# EAGLE design up-rtr_1.0 (EAGLE 5.08)
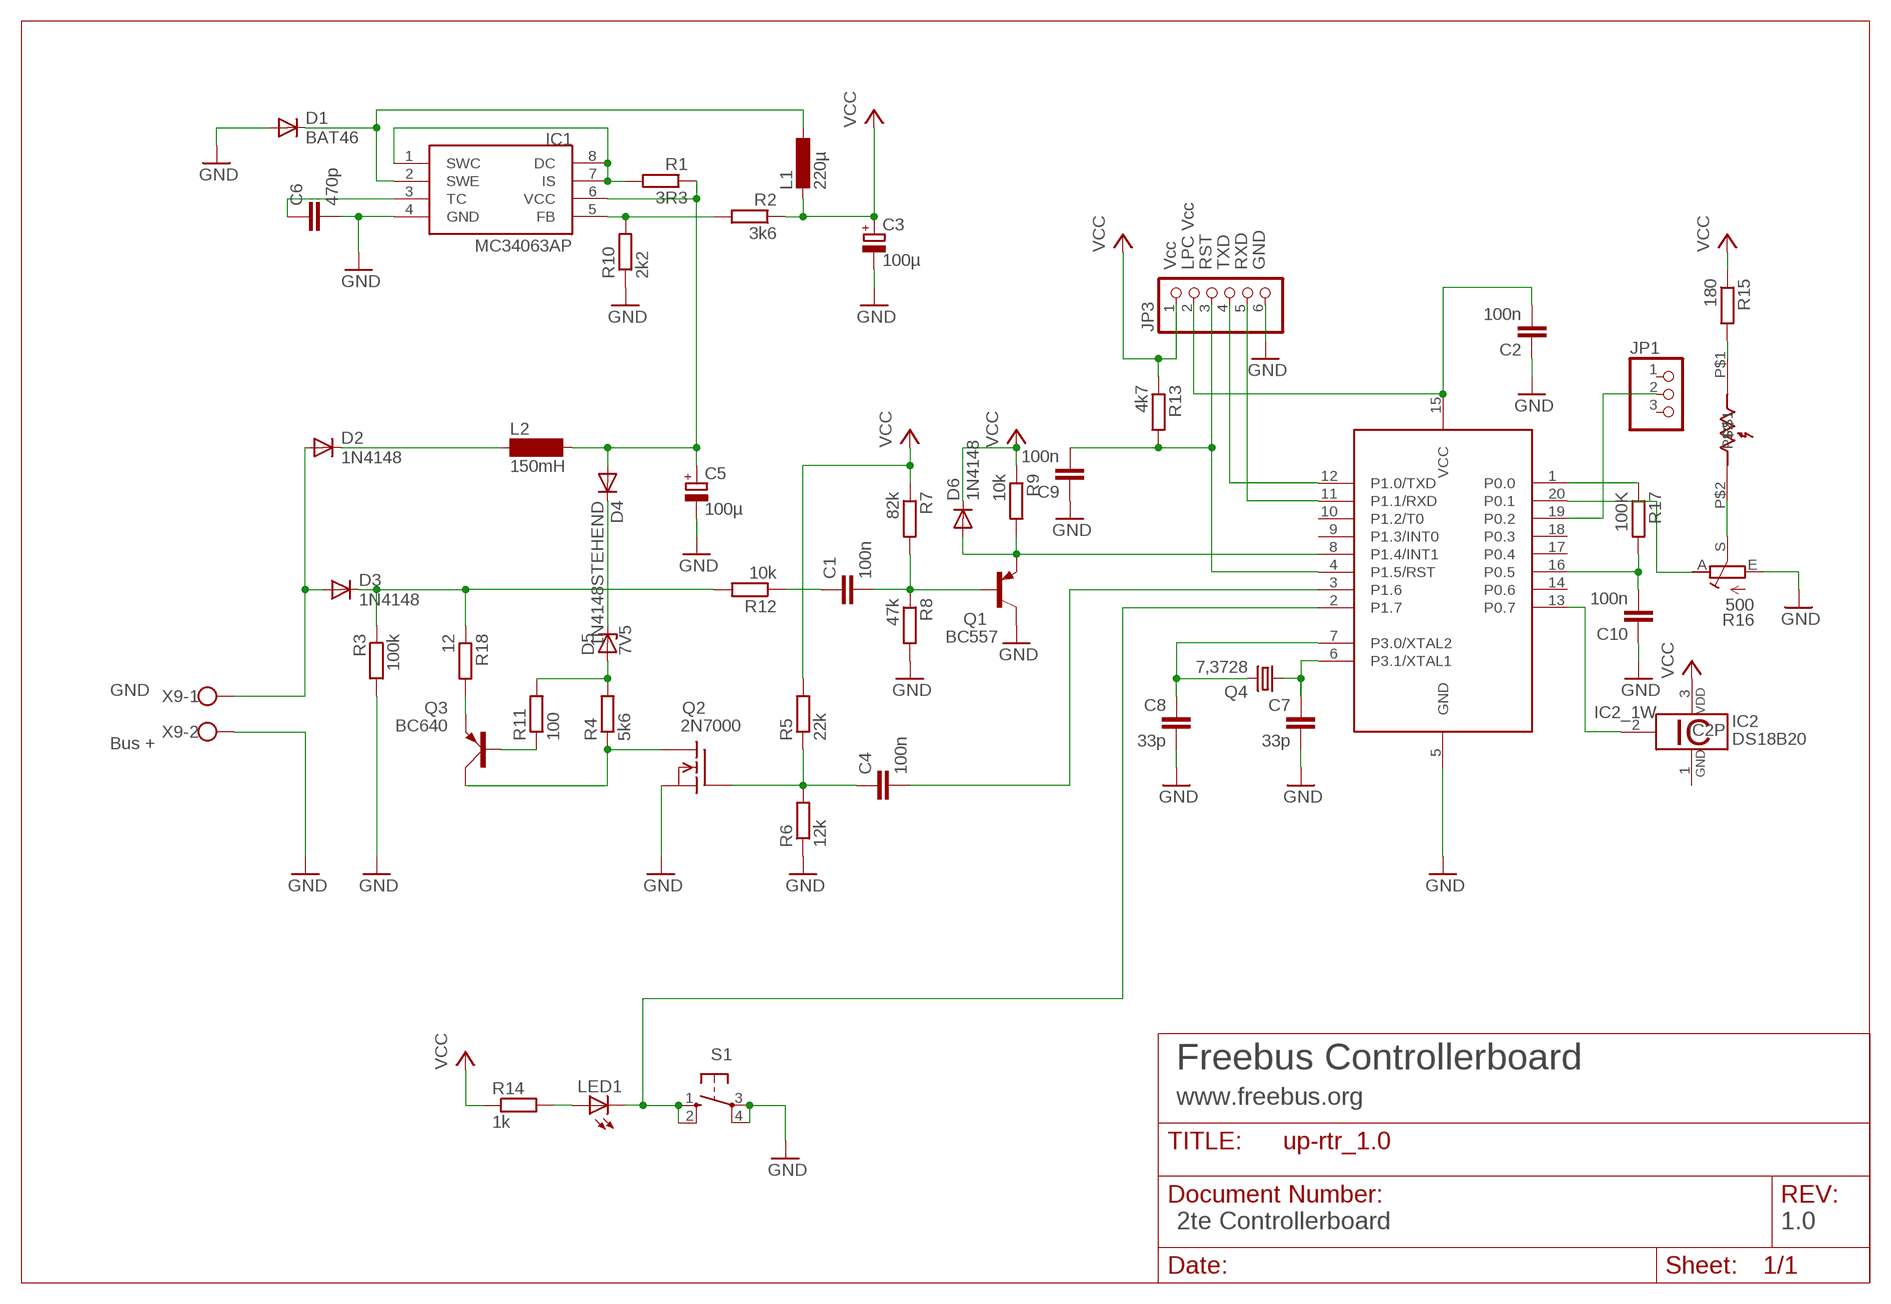
[diagram p0: schematic, sheet 1]

## Parts
89LPC922  89LPC922  [DIL20]
C1  100n  C-EU025-025X050  [C025-025X050]
C2  100n  C-EUC0805  [C0805]
C3  100µ  CPOL-EUE2.5-6  [E2,5-6]
C4  100n  C-EUC0805  [C0805]
C5  100µ  CPOL-EUE3.5-8  [E3,5-8]
C6  470p  C-EUC0805  [C0805]
C7  33p  C-EUC0805  [C0805]
C8  33p  C-EUC0805  [C0805]
C9  100n  C-EUC0805  [C0805]
C10  100n  C-EUC0805  [C0805]
D1  BAT46  BAT81  [DO34-7]
D2  1N4148  1N4148STEHEND  [D-2.5]
D3  1N4148  1N4148STEHEND  [D-2.5]
D4  1N4148STEHEND  [D-2.5]
D5  7V5  ZPDSTEHEND  [ZDIODE]
D6  1N4148  1N4148STEHEND  [D-2.5]
IC1  MC34063AP  [DIL08]
IC2  DS18B20  [TO92-]
JP1  PINHD-1X3  [1X03]
JP3  PINHD-1X6  [1X06]
L1  220µ  L-EU0207/12  [0207/12]
L2  150mH  BS11  [BS11]
LED1  LED3MM  [LED3MM]
Q1  BC557  [TO92]
Q2  2N7000  VN2222KM  [TO237]
Q3  BC640  [SOT54D]
Q4  7,3728  CRYSTALHC49S  [HC49/S]
R1  3R3  R-EU_R0805  [R0805]
R2  3k6  R-EU_R0805  [R0805]
R3  100k  R-EU_R0805  [R0805]
R4  5k6  R-EU_R0805  [R0805]
R5  22k  R-EU_R0805  [R0805]
R6  12k  R-EU_R0805  [R0805]
R7  82k  R-EU_0207/2V  [0207/2V]
R8  47k  R-EU_0207/2V  [0207/2V]
R9  10k  R-EU_0207/2V  [0207/2V]
R10  2k2  R-EU_R0805  [R0805]
R11  100  R-EU_R0805  [R0805]
R12  10k  R-EU_0207/2V  [0207/2V]
R13  4k7  R-EU_R0805  [R0805]
R14  1k  R-EU_R0805  [R0805]
R15  180  R-EU_R0805  [R0805]
R16  500  R-TRIMM-PT6L  [PT6L]
R17  100K  R-EU_R0805  [R0805]
R18  12  R-EU_R0805  [R0805]
RL1  LDR07  [LDR07]
S1  10-XX  [B3F-10XX]
X9  W237-102  [W237-102]

## Nets
/RESET: 89LPC922.4(P1.5/RST) C9.2 JP3.3 R13.2
BASE: C1.2 Q1.2(B) R7.2 R8.1
EIB+: D2.A D3.A X9.1
FETGATE: C4.1 Q2.2(G) R5.1 R6.2
GND: 89LPC922.5(GND) C2.1 C3.- C5.- C6.2 C7.2 C8.2 C9.1 C10.1 D1.A IC1.4(GND) JP3.6 Q1.3(C) Q2.3(S) R3.2 R6.1 R8.2 R10.1 R16.E S1.3(P) S1.4(P1) X9.2
N$1: 89LPC922.8(P1.4/INT1) D6.A Q1.1(E) R9.2
N$2: C1.1 R12.1
N$3: 89LPC922.7(P3.0/XTAL2) C8.1 Q4.2
N$4: D3.C R3.1 R12.2 R18.1
N$5: 89LPC922.3(P1.6) C4.2
N$6: 89LPC922.6(P3.1/XTAL1) C7.1 Q4.1
N$7: 89LPC922.2(P1.7) LED1.K(C) S1.1(S) S1.2(S1)
N$8: IC1.1(SWC) IC1.7(IS) IC1.8(DC) R1.2
N$9: LED1.A R14.2
N$10: C5.+ D4.A IC1.6(VCC) L2.2 R1.1
N$11: IC1.5(FB) R2.2 R10.2
N$12: D1.C IC1.2(SWE) L1.1
N$13: D2.C L2.1
N$14: C6.1 IC1.3(TC)
N$15: D4.C D5.C
N$16: R15.2 RL1.P$1
N$17: R16.S RL1.P$2
N$18: 89LPC922.13(P0.7) IC2.2
N$19: 89LPC922.20(P0.1) R16.A
N$20: 89LPC922.1(P0.0) R17.1
N$21: 89LPC922.16(P0.5) C10.2 R17.2
N$22: 89LPC922.19(P0.2) JP1.2
N$25: D5.A R4.2 R11.2
N$26: Q2.1(D) Q3.C R4.1
N$28: Q3.B R11.1
N$29: 89LPC922.12(P1.0/TXD) JP3.4
N$30: 89LPC922.11(P1.1/RXD) JP3.5
N$32: 89LPC922.15(VCC) C2.2 JP3.2
N$33: Q3.E R18.2
VCC: C3.+ D6.C IC2.3 JP3.1 L1.2 R2.1 R5.2 R7.1 R9.1 R13.1 R14.1 R15.1
Unconnected: 89LPC922.9(P1.3/INT0) 89LPC922.10(P1.2/T0) 89LPC922.14(P0.6) 89LPC922.17(P0.4) 89LPC922.18(P0.3) JP1.1 JP1.3

## Notes on the sheet
- Vcc | LPC Vcc | RST | TXD | RXD | GND
- GND
- Bus +
- Freebus Controllerboard
- www.freebus.org
- 2te Controllerboard | 1.0

## Power pins joined to a net without a drawn wire
GND: IC2.1

## Library data of the parts
89LPC922 = micro-philips:89LPC922
C1 C2 C4 C6-C10 = rcl:C-EU: CAPACITOR, European symbol
C3 C5 = rcl:CPOL-EU: POLARIZED CAPACITOR, European symbol
D1 = diode:BAT81: DIODE barrier diode
D2-D4 D6 = diode:1N4148: DIODE high speed (Philips)
D5 = diode:ZPD: Z DIODE 500 mW
IC1 = mc34063:MC34063
IC2 = 1wire:DS18B20: Programmable Resolution Digital Thermometer This chip provides a onewire thermosensor with approx. 0.5°C accuracy. A programmable over/undertemperure alarm is available. The precision can be set from 9..12 bits. Notes: Vdd must be applied for accurate measurements at low temperatures, as the parasite power circuit otherwise heats the sensor. If parasite power is used, Vdd has to be connected to GND. The DS1822 is a low-cost thermometer chip, the DS18S20 is similar to the DS18B20, but with 9 Bit precision only. Author: Jan Kandziora <jjj@gmx.de>
JP1 = pinhead:PINHD-1X3: PIN HEADER
JP3 = pinhead:PINHD-1X6: PIN HEADER
L1 = rcl:L-EU: INDUCTOR, European symbol
L2 = inductor-neosid:BS: INDUCTOR nominal inductance, magnetically screened
LED1 = led:LED: LED OSRAM: - CHIPLED LG R971, LG N971, LY N971, LG Q971, LY Q971, LO R971, LY R971 LH N974, LH R974 LS Q976, LO Q976, LY Q976 LO Q996 - Hyper CHIPLED LW Q18S LB Q993, LB Q99A, LB R99A - SideLED LS A670, LO A670, LY A670, LG A670, LP A670 LB A673, LV A673, LT A673, LW A673 LH A674 LY A675 LS A676, LA A676, LO A676, LY A676, LW A676 LS A679, LY A679, LG A679 - Hyper Micro SIDELED® LS Y876, LA Y876, LO Y876, LY Y876 LT Y87S - SmartLED LW L88C, LW L88S LB L89C, LB L89S, LG L890 LS L89K, LO L89K, LY L89K LS L896, LA L896, LO L896, LY L896 - TOPLED LS T670, LO T670, LY T670, LG T670, LP T670 LSG T670, LSP T670, LSY T670, LOP T670, LYG T670 LG T671, LOG T671, LSG T671 LB T673, LV T673, LT T673, LW T673 LH T674 LS T676, LA T676, LO T676, LY T676, LB T676, LH T676, LSB T676, LW T676 LB T67C, LV T67C, LT T67C, LS T67K, LO T67K, LY T67K, LW E67C LS E67B, LA E67B, LO E67B, LY E67B, LB E67C, LV E67C, LT E67C LW T67C LS T679, LY T679, LG T679 LS T770, LO T770, LY T770, LG T770, LP T770 LB T773, LV T773, LT T773, LW T773 LH T774 LS E675, LA E675, LY E675, LS T675 LS T776, LA T776, LO T776, LY T776, LB T776 LHGB T686 LT T68C, LB T68C - Hyper Mini TOPLED® LB M676 - Mini TOPLED Santana® LG M470 LS M47K, LO M47K, LY M47K Source: http://www.osram.convergy.de - LUMILED® LXK2-PW12-R00, LXK2-PW12-S00, LXK2-PW14-U00, LXK2-PW14-V00 LXK2-PM12-R00, LXK2-PM12-S00, LXK2-PM14-U00 LXK2-PE12-Q00, LXK2-PE12-R00, LXK2-PE12-S00, LXK2-PE14-T00, LXK2-PE14-U00 LXK2-PB12-K00, LXK2-PB12-L00, LXK2-PB12-M00, LXK2-PB14-N00, LXK2-PB14-P00, LXK2-PB14-Q00 LXK2-PR12-L00, LXK2-PR12-M00, LXK2-PR14-Q00, LXK2-PR14-R00 LXK2-PD12-Q00, LXK2-PD12-R00, LXK2-PD12-S00 LXK2-PH12-R00, LXK2-PH12-S00 LXK2-PL12-P00, LXK2-PL12-Q00, LXK2-PL12-R00 Source: www.luxeon.com
Q1 = transistor-pnp:BC557: PNP Transistor
Q2 = transistor-fet:VN2222KM: N-Channel Enhancement MOSFET (VMOS); 60V; 0,5A; 7,5Ohm
Q3 = transistor-small-signal:BC640: PNP TRANSISTOR
Q4 = crystal:CRYSTAL: CRYSTAL
R1-R15 R17 R18 = rcl:R-EU_: RESISTOR, European symbol
R16 = kubi:R-TRIMM
RL1 = ldr:LDR07
S1 = switch-omron:10-XX: OMRON SWITCH
X9 = con-wago-500:W237-102: WAGO SCREW CLAMP

## Board
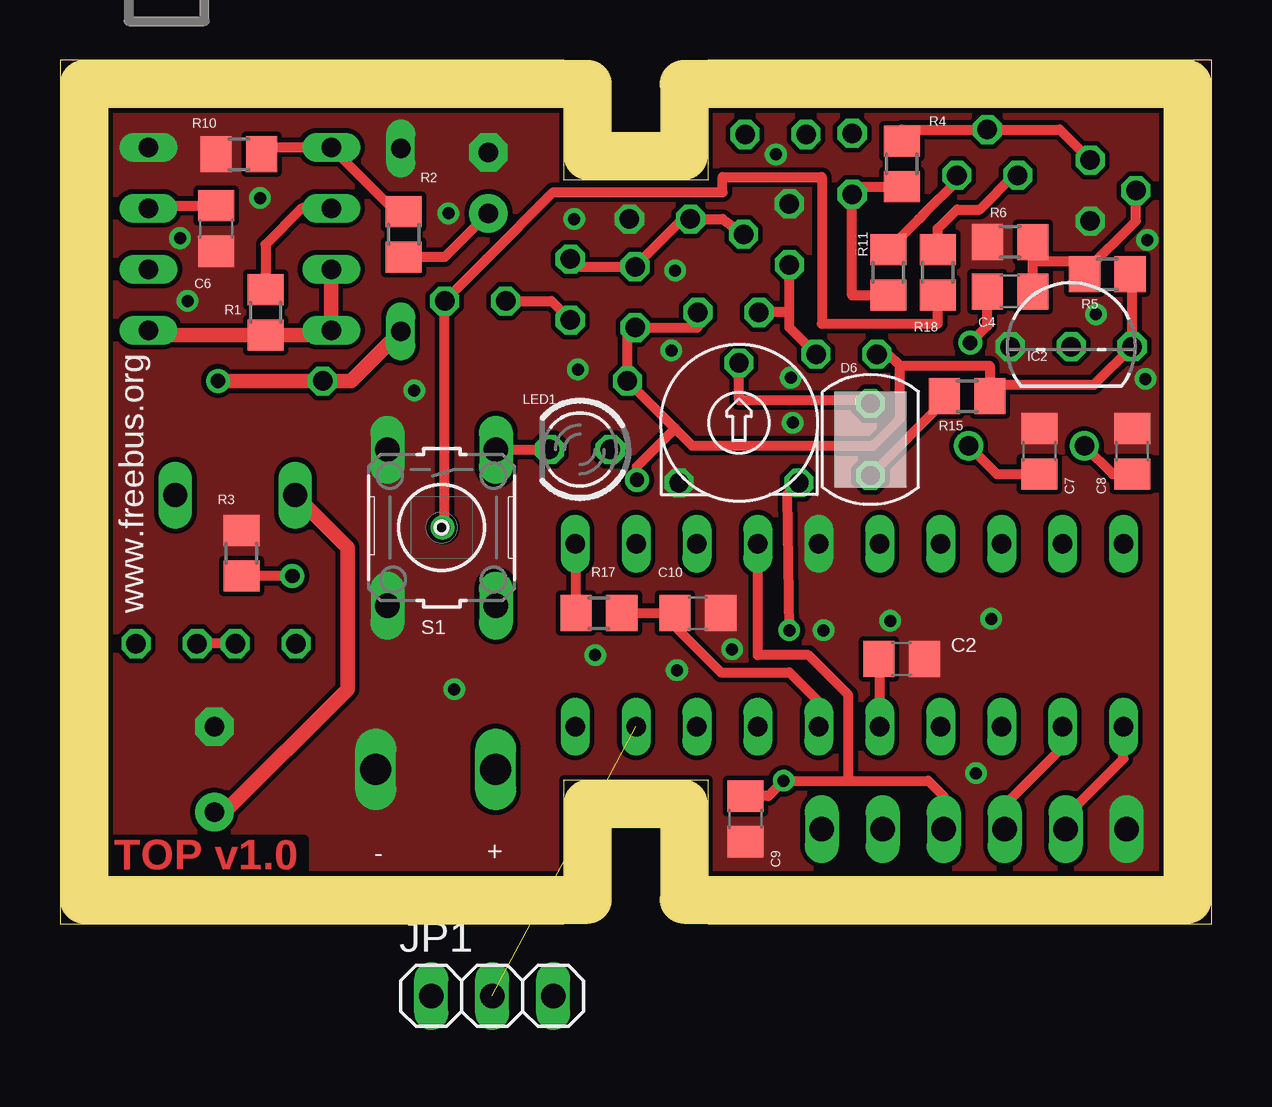
[diagram p1: board, top side]
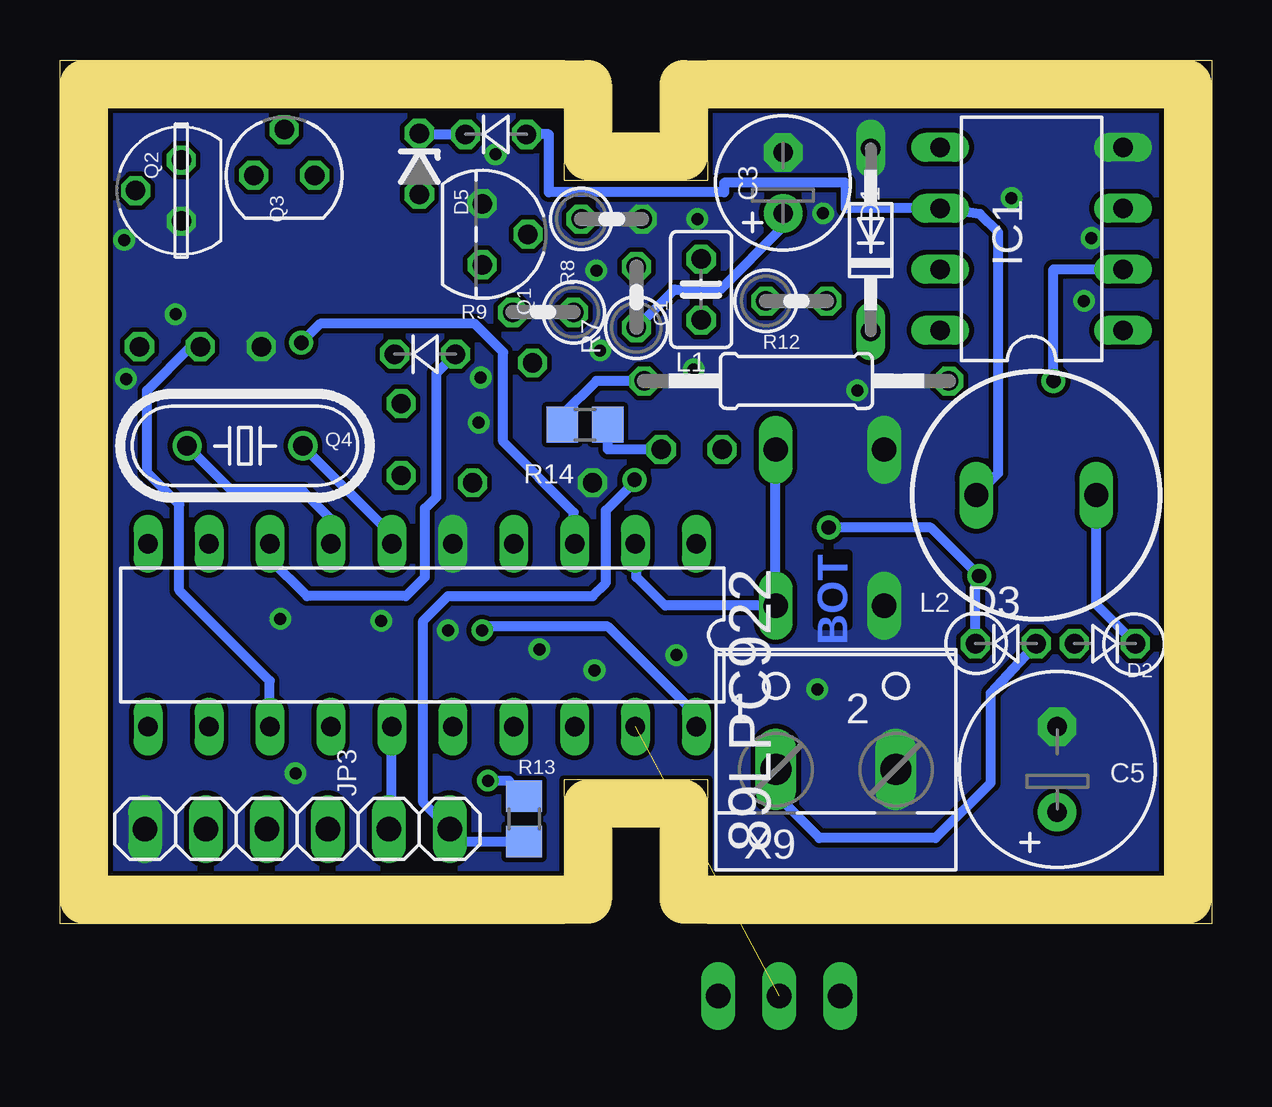
[diagram p2: board, bottom side, seen from below]

Size 48 x 36 mm. Coordinates in mm from the lower left corner, seen from the top.
Outline: 0,0 21,0 21,6 27,6 27,0 48,0 48,36 27,36 27,31 21,31 21,36 0,36 0,0
Outline: 1,1 22,1 22,5 26,5 26,1 47,1 47,35 26,35 26,32 22,32 22,35 1,35 1,1
Copper layers (1*16): Top 0.035mm / dielectric 1.5mm / Bottom 0.035mm
Design rules "ZWILLING": minimum track width 0.2mm, minimum drill 0.5mm, track to track 0.2mm, track to pad 0.2mm, pad to pad 0.15mm, via to via 0.2mm, smd to smd 0mil, copper to edge 0.2mm, drill to drill 0.2mm, minimum pad ring 0.2mm, minimum via ring 0.2mm, stop-mask expansion 0.1mm, vias tented up to drill 0mil, thermal gap 10mil

### Footprints (pad centres in the part's own frame; a part is rotated, then mirrored left to right if it is on the bottom)
DIL20@1 = drill 0.813 long: 1 -11.43,-3.81; 2 -8.89,-3.81; 3 -6.35,-3.81; 4 -3.81,-3.81; 5 -1.27,-3.81; 6 1.27,-3.81; 7 3.81,-3.81; 8 6.35,-3.81; 9 8.89,-3.81; 10 11.43,-3.81; 11 11.43,3.81; 12 8.89,3.81; 13 6.35,3.81; 14 3.81,3.81; 15 1.27,3.81; 16 -1.27,3.81; 17 -3.81,3.81; 18 -6.35,3.81; 19 -8.89,3.81; 20 -11.43,3.81
C025-025X050 = drill 0.813 octagon: 1 -1.27,0; 2 1.27,0
C0805 = smd 1.3 x 1.5: 1 -0.95,0; 2 0.95,0
E2,5-6 = drill 0.813 pad 1.6 round: + -1.27,0 | drill 0.813 pad 1.6 octagon: - 1.27,0
E3,5-8 = drill 0.813 pad 1.6 round: + -1.778,0 | drill 0.813 pad 1.6 octagon: - 1.778,0
DO34-7 = drill 0.813 long: A 3.81,0; C -3.81,0
D-2.5 = drill 0.813 octagon: A 1.27,0; C -1.27,0
ZDIODE = drill 0.813 octagon: A 1.27,0; C -1.27,0
DIL08 = drill 0.813 long: 1 -3.81,-3.81; 2 -1.27,-3.81; 3 1.27,-3.81; 4 3.81,-3.81; 5 3.81,3.81; 6 1.27,3.81; 7 -1.27,3.81; 8 -3.81,3.81
TO92- = drill 0.813 octagon: 1 -2.54,0; 2 0,0; 3 2.54,0
1X03 = drill 1.016 long: 1 -2.54,0; 2 0,0; 3 2.54,0
1X06 = drill 1.016 long: 1 -6.35,0; 2 -3.81,0; 3 -1.27,0; 4 1.27,0; 5 3.81,0; 6 6.35,0
0207/12 = drill 0.813 octagon: 1 -6.35,0; 2 6.35,0
BS11 = drill 1 long: 1 -2.5,0; 2 2.5,0
LED3MM = drill 0.813 octagon: A -1.27,0; K 1.27,0
TO92 = drill 0.813 octagon: 1 1.27,0; 2 0,1.905; 3 -1.27,0
TO237 = drill 0.813 octagon: 1 1.27,0; 2 0,1.905; 3 -1.27,0
SOT54D = drill 0.813 octagon: B 1.27,0; C 0,1.905; E -1.27,0
HC49/S = drill 0.813 round: 1 -2.413,0; 2 2.413,0
R0805 = smd 1.3 x 1.5: 1 -0.95,0; 2 0.95,0
0207/2V = drill 0.813 octagon: 1 -1.27,0; 2 1.27,0
PT6L = drill 0.8 octagon: A 2.5,2.5; E 2.5,-2.5; S -2.5,0
LDR07 = drill 0.8 octagon: P$1 -1.5,0; P$2 1.5,0
B3F-10XX = drill 1.016 long: 1 -3.251,2.261; 2 3.251,2.261; 3 -3.251,-2.261; 4 3.251,-2.261
W237-102 = drill 1.3 long: 1 -2.5,-1.27; 2 2.5,-1.27

### Placement (x,y rotation side)
89LPC922  89LPC922  [DIL20@1]  32.9,12.02 180 bottom
C1  21.27,26.43 90 bottom
C2  35.08,11.03 180 top
C3  17.86,30.88 90 bottom
C4  39.61,26.35 180 top
C5  6.43,6.43 90 bottom
C6  6.51,28.97 270 top
C7  40.83,19.68 90 top
C8  44.69,19.69 90 top
C9  28.57,4.37 90 top
C10  26.59,12.94 180 top
D1  14.21,28.5 90 bottom
D2  4.45,11.67 180 bottom
D3  8.57,11.67 0 bottom
D4  29.83,32.9 0 bottom
D5  33.02,31.67 270 bottom
D6  32.78,23.73 0 bottom
IC1  7.5,28.54 90 bottom
IC2  42.15,24.05 0 top
JP1  18.02,-3.02 0 top  (outside the outline)
JP3  38.11,3.94 180 bottom
L1  17.3,22.62 180 bottom
L2  7.31,17.86 180 bottom
LED1  21.67,19.76 180 top
Q1  30.4,28.73 270 bottom
Q2  42.94,30.56 90 bottom
Q3  38.66,31.19 0 bottom
Q4  40.29,19.92 180 bottom
R1  8.57,25.48 270 top
R2  14.33,28.73 90 top
R3  7.57,15.44 90 top
R4  35.08,31.67 270 top
R5  43.66,27.07 0 top
R6  39.61,28.42 0 top
R7  23.97,26.11 90 bottom
R8  25,29.37 0 bottom
R9  27.86,25.48 180 bottom
R10  7.46,32.07 0 top
R11  34.53,27.15 270 top
R12  17.3,25.96 0 bottom
R13  28.65,4.37 90 bottom
R14  26.11,20.8 0 bottom
R15  37.81,21.99 180 top
R16  28.3,20.88 270 top
R17  22.46,12.94 0 top
R18  36.59,27.15 90 top
RL1  33.78,20.18 90 top
S1  15.91,16.51 270 top
X9  15.66,7.69 0 bottom

### Tracks (layer width: path | path; a pad name or v marks a point on that pad's centre or on a via)
/RESET  (via drill 0.5)
  Top 0.406: C9.2 29.52,5.32 v30.16,5.95 32.94,5.95 | 32.94,5.95 36.2,5.95 36.83,5.32 JP3.3 | 89LPC922.4 29.09,11.19 31.19,11.19 32.86,9.53 32.86,6.03 32.94,5.95
  Bottom 0.406: v30.16,5.95 29.29,5.95 R13.2
BASE
  Top 0.406: Q1.2 27.62,29.37 R8.1 25.96,29.37 R7.2 21.59,27.38 C1.2
EIB+
  Top 0.406: D2.A D3.A
  Bottom 0.406: X9.1 18.16,5.38 16.35,3.57 11.51,3.57 9.21,5.87 9.21,9.6 D3.A
FETGATE
  Top 0.406: Q2.2 44.85,29.29 42.7,27.15 | 42.7,27.15 42.7,26.51 R5.1 | C4.1 40.56,27.62 | 40.56,27.62 R6.2 | 42.7,27.15 42.7,27.62 40.56,27.62
GND  (via drill 0.5)
  other vias: 22.3,11.19 30.46,22.76 8.33,30.24 45.32,28.5 45.24,22.7 38.18,6.27 34.61,12.62 29.84,32.07 38.81,12.7 21.59,23.1 21.43,29.37 16.19,29.61 14.76,22.23 25.48,23.89 30.54,20.88 16.43,9.76 31.83,12.22 25.72,10.56 28.02,11.43 5.32,25.96 5,28.57 43.18,25.4 25.64,27.23
  pour Bottom (no thermals): -0.06,36.03 47.98,36.03 47.98,0 0,0
  pour Top (no thermals): 47.98,36.03 47.98,0 0,0 0,36.03
N$1
  Top 0.406: D6.A 30.4,24.84 30.4,25.48 | 30.4,25.48 Q1.1 | 30.4,25.48 R9.2
  Bottom 0.406: 89LPC922.8 39.25,15.2 37.7,13.65 33.58,13.65 32.78,14.45 32.78,17.3 32.31,17.78 32.31,22.94 D6.A
N$2
  Top 0.406: C1.1 20.48,25.95 R12.1
N$3
  Top 0.406: Q4.2 43.88,18.73 C8.1
  Bottom 0.406: Q4.2 40.8,18.02 37.86,18.02 36.71,16.87 89LPC922.7
N$4  (via drill 0.6)
  Top 0.406: v9.68,14.49 R3.1 | R18.1 36.59,25 31.75,25 31.75,31.11 27.62,31.11 27.62,30.48 20.56,30.48 17.78,27.7 R12.2 16.03,16.59 v15.95,16.51
  Bottom 0.406: D3.C 9.84,14.33 v9.68,14.49 11.7,16.51 v15.95,16.51
N$5  (via drill 0.6)
  Top 0.406: v37.94,24.21 38.66,24.93 C4.2
  Bottom 0.406: v37.94,24.21 37.15,25 30.72,25 29.53,23.82 29.53,20.09 26.59,17.14 26.59,15.87 89LPC922.3
N$6
  Top 0.406: Q4.1 39.06,18.73 C7.1
  Bottom 0.406: Q4.1 34.17,16.21 89LPC922.6
N$7
  Top 0.406: S1.1 LED1.K
  Bottom 0.406: 89LPC922.2 23.97,15.79 23.97,14.45 22.78,13.26 S1.2 S1.1
N$8
  Top 0.406: 11.43,24.53 IC1.8
  Top 0.61: IC1.8 IC1.7 | 11.43,24.53 R1.2 3.88,24.53 IC1.1
N$9
  Bottom 0.406: LED1.A 25.16,19.76 R14.2
N$10
  Top 0.406: R1.1 8.57,28.31 10.08,29.81 IC1.6
  Top 0.61: L2.2 11.99,15.68 11.99,9.76 6.87,4.65 C5.+
  Bottom 0.406: L2.2 8.89,18.78 8.89,28.81 9.65,29.58 IC1.6 15.24,29.81 15.24,30.88 20.32,30.88 20.32,30.48 27.62,30.48 27.62,32.9 D4.A
N$11
  Top 0.406: R2.2 13.98,29.68 IC1.5 8.7,32.35 R10.2
N$12  (via drill 0.6)
  Top 0.61: D1.C 12.14,22.62 L1.1 v6.59,22.62
  Bottom 0.406: v6.59,22.62 6.59,27.27 IC1.2
N$13
  Bottom 0.406: D2.C 4.81,13.3 L2.1
N$14
  Top 0.406: C6.1 3.72,29.92 IC1.3
N$15
  Bottom 0.406: D4.C 32.98,32.9 D5.C
N$16
  Top 0.406: RL1.P$1 37.06,21.96 R15.2
N$17
  Top 0.406: RL1.P$2 33.78,21.83 28.3,21.82 R16.S
N$18
  Bottom 0.406: 89LPC922.13 39.25,10.12 43.02,13.89 43.02,17.46 44.37,18.81 44.37,22.23 42.55,24.05 IC2.2
N$19  (via drill 0.5)
  Top 0.406: v30.4,12.22 30.32,17.89 R16.A
  Bottom 0.406: 89LPC922.20 arc90 21.51,8.25 21.51,8.73 25.16,12.38 30.24,12.38 v30.4,12.22
N$20
  Top 0.406: R17.1 21.51,15.79 89LPC922.1
N$21
  Top 0.406: 89LPC922.16 31.59,8.25 31.59,9.29 30.4,10.48 27.54,10.48 25.64,12.38 C10.2 R17.2 | R17.2
N$22  (1 unrouted)
N$25
  Top 0.406: R11.2 33.02,26.2 D5.A 33.34,30.72 R4.2
N$26
  Top 0.406: Q2.1 41.67,33.1 Q3.C 35.09,33.1 R4.1
N$28
  Top 0.406: Q3.B 37.39,30.96 36.04,29.61 35.8,29.37 R11.1
N$29
  Top 0.406: 89LPC922.12 41.79,7.34 39.37,4.92 JP3.4
N$30
  Top 0.406: 89LPC922.11 44.33,6.87 41.99,4.52 41.99,4.02 JP3.5
N$32
  Top 0.406: 89LPC922.15 34.17,11 C2.2
  Bottom 0.406: JP3.2 34.17,3.94 89LPC922.15
N$33
  Top 0.406: Q3.E 39.77,31.19 38.34,29.77 37.39,29.77 36.59,28.97 R18.2 | R18.2
VCC  (via drill 0.6)
  Top 0.406: 25.64,20.64 L1.2 23.65,24.84 R7.1 26.59,24.84 R9.1 | 25.64,20.64 26.35,19.92 33.9,19.92 35.01,21.03 35.01,23.26 | R2.1 16.03,27.78 C3.+ | 35.01,23.26 34.51,23.73 D6.C | 35.01,23.26 38.7,23.26 38.76,23.26 38.76,22.46 | v24.05,18.49 24.05,19.05 25.64,20.64 | 38.76,22.46 R15.1 | 38.76,22.46 43.1,22.46 IC2.3 44.69,27.07 R5.2
  Bottom 0.406: R13.1 31.23,3.42 JP3.1 32.86,5.05 32.86,12.62 31.83,13.65 25.8,13.65 25.24,14.21 25.24,17.22 24.05,18.41 v24.05,18.49 | R14.1 27.06,21.2 25.64,22.62 L1.2 | C3.+ 17.86,29.05 20.48,26.43 22.38,26.43 R7.1

### Text on the board
Top: TOP v1.0
Bottom: BOT
tPlace: IO6 | IO7 | - | +
tNames: 1,8V | PWM | GND | ISP | 1,2V | VCC | www.freebus.org | LPC 2te 3.6